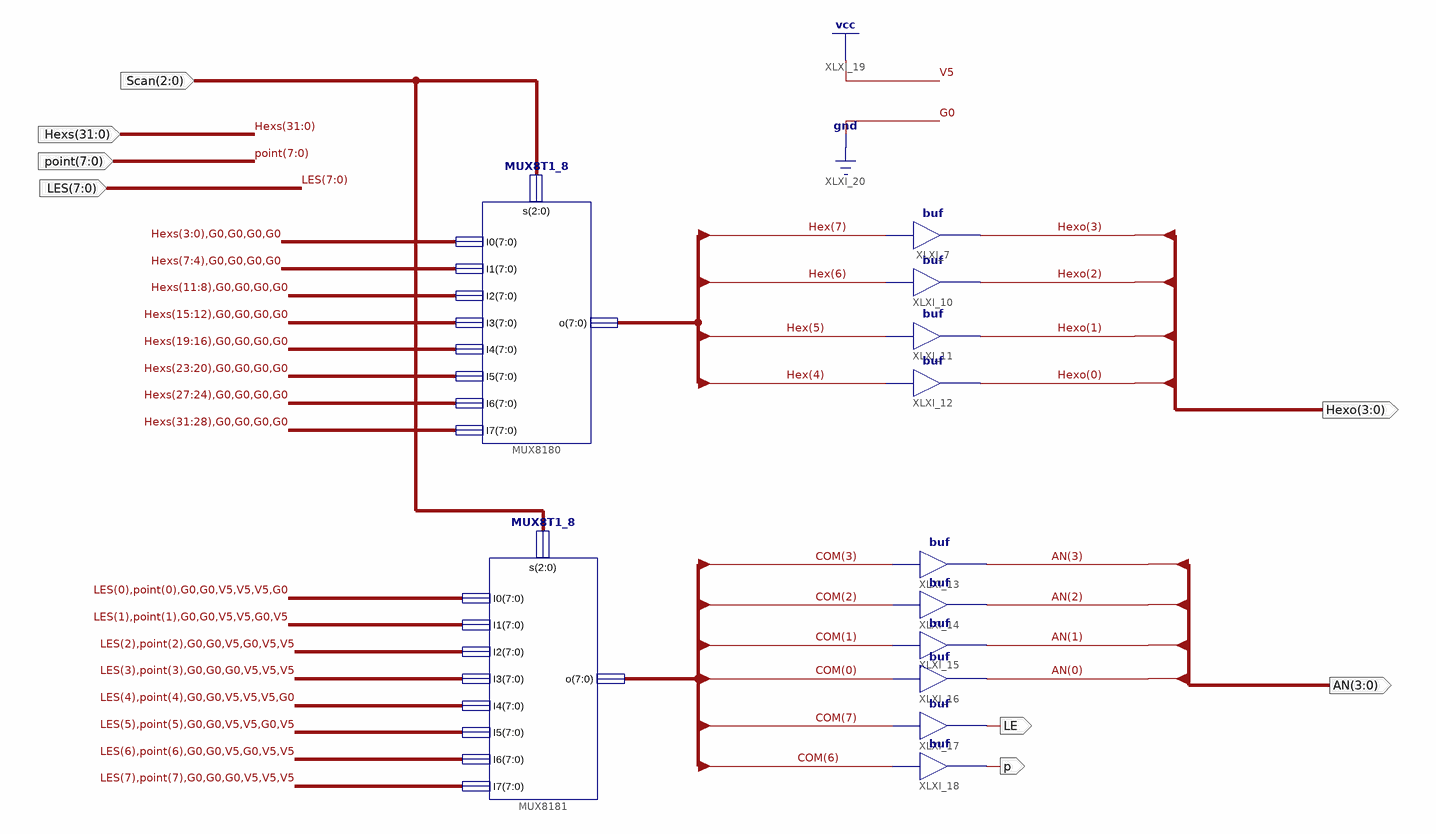
[diagram p0: schematic sheet 1]
// Xilinx ISE schematic ScanSync.sch (kintex7) as structural Verilog: 12 symbols, 8 ports
module ScanSync (
  input  [2:0] Scan,
  input  [31:0] Hexs,
  input  [7:0] point,
  input  [7:0] LES,
  output [3:0] Hexo,
  output [3:0] AN,
  output LE,
  output p
);

  wire [7:0] COM, Hex;

  MUX8T1_8 MUX8180 (
    .I0({Hexs[3:0], 4'b0000}), .I1({Hexs[7:4], 4'b0000}), .I2({Hexs[11:8], 4'b0000}),
    .I3({Hexs[15:12], 4'b0000}), .I4({Hexs[19:16], 4'b0000}), .I5({Hexs[23:20], 4'b0000}),
    .I6({Hexs[27:24], 4'b0000}), .I7({Hexs[31:28], 4'b0000}), .o(Hex), .s(Scan));
  MUX8T1_8 MUX8181 (
    .I0({LES[0], point[0], 6'b001110}), .I1({LES[1], point[1], 6'b001101}),
    .I2({LES[2], point[2], 6'b001011}), .I3({LES[3], point[3], 6'b000111}),
    .I4({LES[4], point[4], 6'b001110}), .I5({LES[5], point[5], 6'b001101}),
    .I6({LES[6], point[6], 6'b001011}), .I7({LES[7], point[7], 6'b000111}), .o(COM), .s(Scan));
  buf XLXI_7 (Hexo[3], Hex[7]);
  buf XLXI_10 (Hexo[2], Hex[6]);
  buf XLXI_11 (Hexo[1], Hex[5]);
  buf XLXI_12 (Hexo[0], Hex[4]);
  buf XLXI_13 (AN[3], COM[3]);
  buf XLXI_14 (AN[2], COM[2]);
  buf XLXI_15 (AN[1], COM[1]);
  buf XLXI_16 (AN[0], COM[0]);
  buf XLXI_17 (LE, COM[7]);
  buf XLXI_18 (p, COM[6]);
endmodule
